# EAGLE design Atmel_ICE3_Adapter_10Pin (EAGLE 6.6.0)
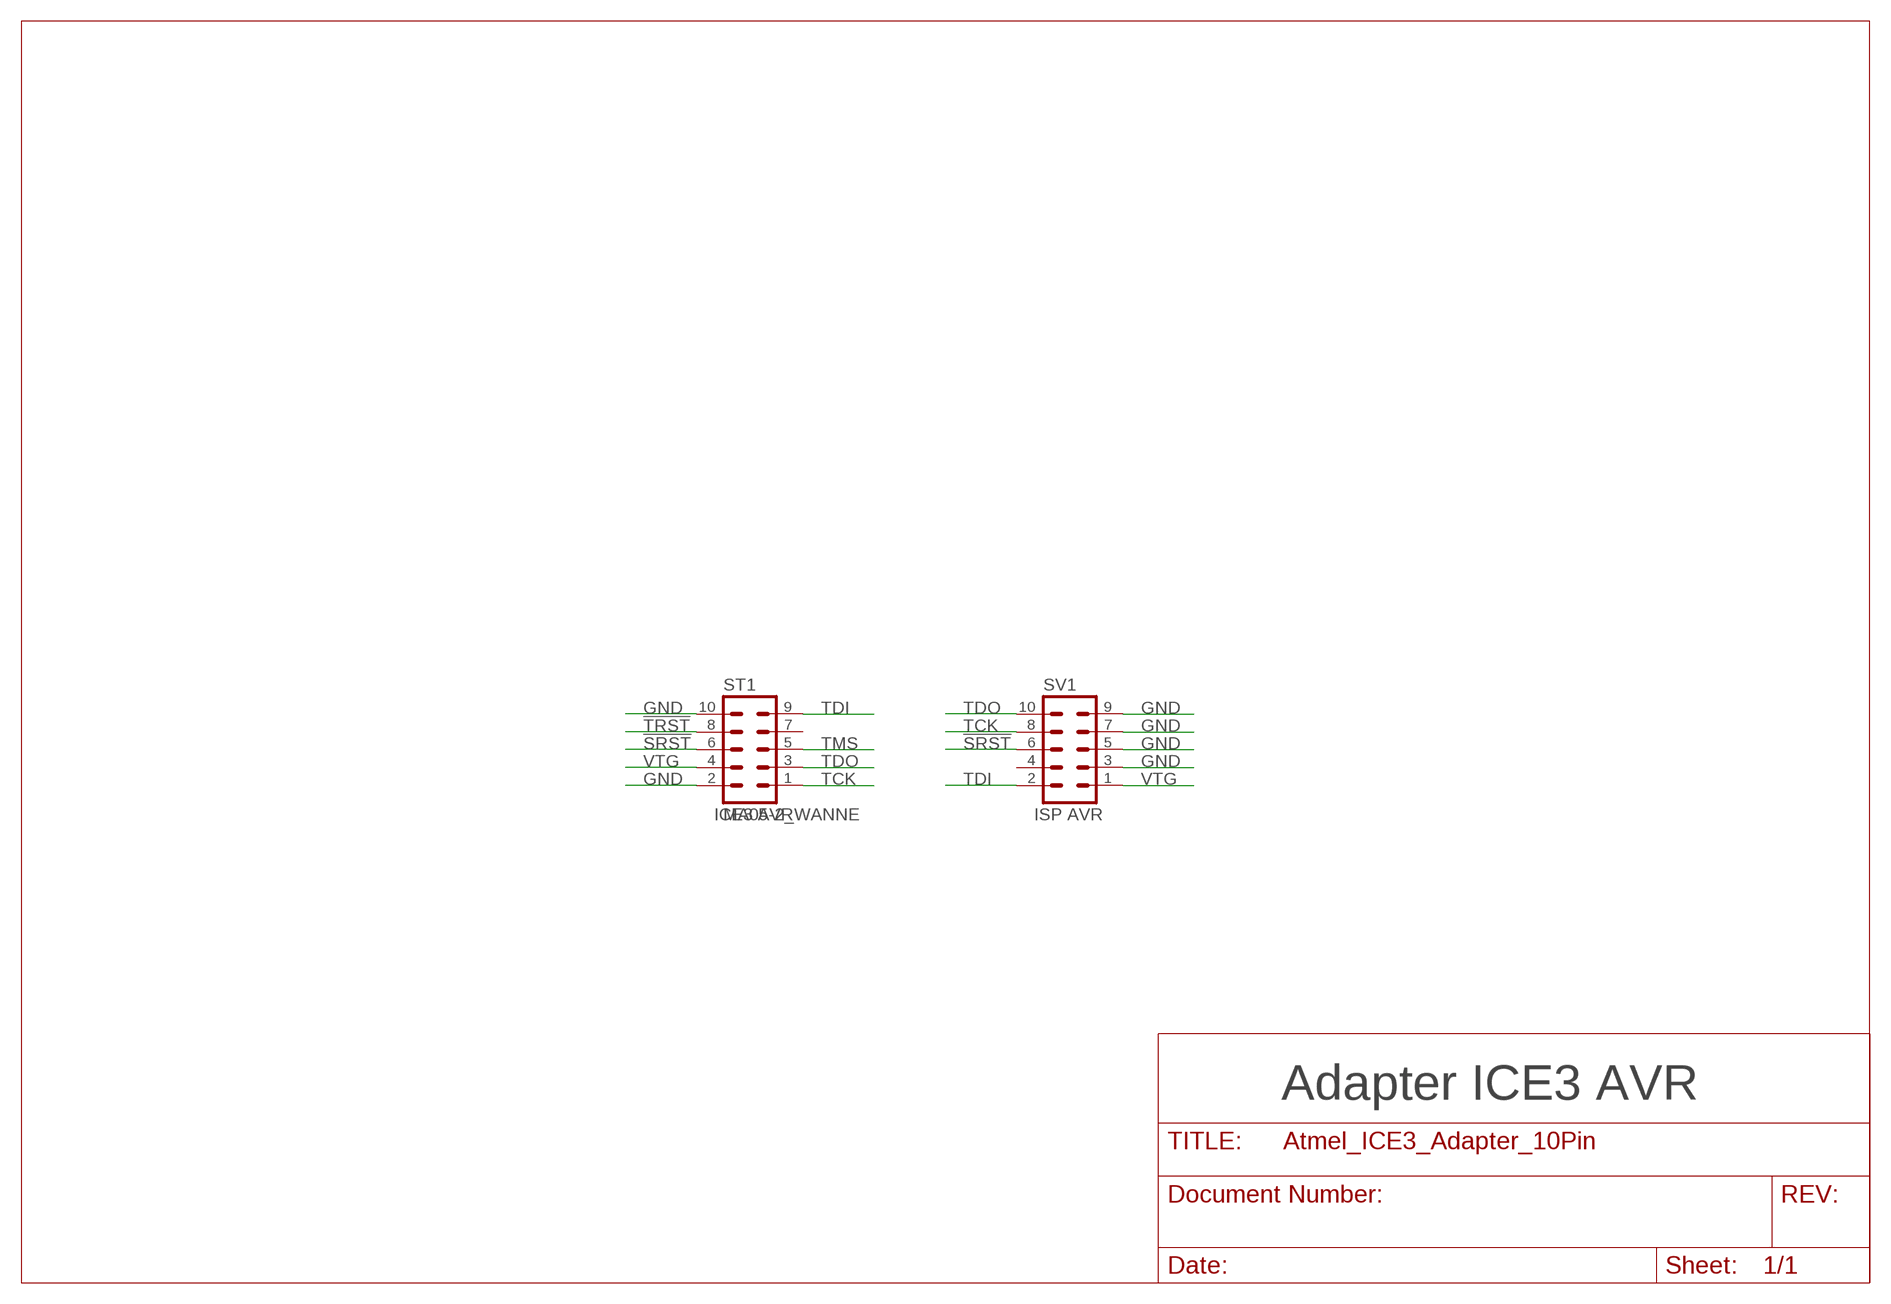
[diagram p0: schematic, sheet 1]

## Parts
ST1  MA05-2_WANNE  [MA05-2_WANNE]
SV1  MA05-2  [MA05-2]

## Nets
!SRST: ST1.6 SV1.6
!TRST: ST1.8
GND [pwr]: ST1.2 ST1.10 SV1.3 SV1.5 SV1.7 SV1.9
TCK: ST1.1 SV1.8
TDI: ST1.9 SV1.2
TDO: ST1.3 SV1.10
TMS: ST1.5
VTG [pwr]: ST1.4 SV1.1
Unconnected: ST1.7 SV1.4

## Notes on the sheet
- ICE3 AVR | ISP AVR
- Adapter ICE3 AVR

## Library data of the parts
ST1 = pin-header-1.27:MA05-2_WANNE
SV1 = con-lstb:MA05-2: PIN HEADER; OC_FARNELL: unknown; OC_NEWARK: unknown

## Board
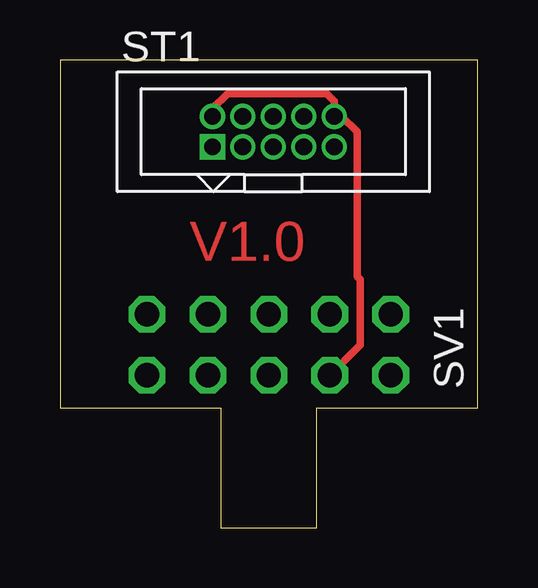
[diagram p1: board, top side]
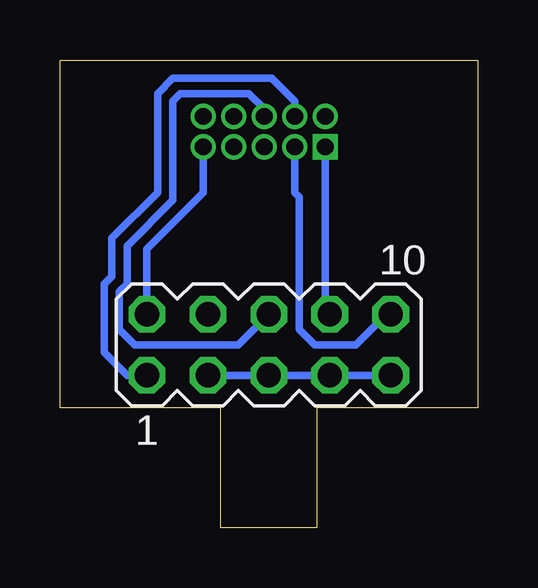
[diagram p2: board, bottom side, seen from below]

Size 17.4 x 19.5 mm. Coordinates in mm from the lower left corner, seen from the top.
Outline: 0,5 6.7,5 6.7,0 10.7,0 10.7,5 17.4,5 17.4,19.5 0,19.5 0,5
Copper layers (1*16): Top 0.035mm / dielectric 1.6mm / Bottom 0.035mm
Design rules "Elecrow_2-layer_PCB_eagle_rule": minimum track width 6mil, minimum drill 12mil, track to track 6mil, track to pad 6mil, pad to pad 6mil, via to via 8mil, smd to smd 0mil, copper to edge 20mil, drill to drill 10mil, minimum pad ring 6mil, minimum via ring 6mil, stop-mask expansion 0mil, vias tented up to drill 100mil, thermal gap 10mil
vRestrict: area 8.9,43.2 to 20.3,44.5; area 1.3,38.1 to 11.4,39.4; area 1.3,25.4 to 11.4,26.7; area 1.3,15.2 to 12.7,16.5; area 31.8,27.9 to 41.9,29.2; area 26.7,40.6 to 38.1,41.9; area 26.7,43.2 to 27.9,44.5; area 36.8,43.2 to 44.5,44.5; area 1.9,41.3 to 2.5,42.5; area 1.3,31.8 to 2.5,33; area 1.3,19.1 to 2.5,20.3; area 1.3,3.8 to 2.5,5.1; 2 more areas

### Footprints (pad centres in the part's own frame; a part is rotated, then mirrored left to right if it is on the bottom)
MA05-2_WANNE = drill 0.7 pad 1.016 square: 1 -2.54,-0.635 | drill 0.7 pad 1.016: 2 -2.54,0.635; 3 -1.27,-0.635; 4 -1.27,0.635; 5 0,-0.635; 6 0,0.635; 7 1.27,-0.635; 8 1.27,0.635; 9 2.54,-0.635; 10 2.54,0.635
MA05-2 = drill 1.016 octagon: 1 -5.08,-1.27; 2 -5.08,1.27; 3 -2.54,-1.27; 4 -2.54,1.27; 5 0,-1.27; 6 0,1.27; 7 2.54,-1.27; 8 2.54,1.27; 9 5.08,-1.27; 10 5.08,1.27

### Placement (x,y rotation side)
ST1  8.89,16.51 0 top
SV1  8.7,7.62 0 bottom

### Tracks (layer width: path | path; a pad name or v marks a point on that pad's centre or on a via)
!SRST
  Bottom 0.305: ST1.6 8.89,17.46 9.53,18.1 12.38,18.1 12.7,17.78 12.7,13.65 14.61,11.75 14.61,10.16 14.92,9.84 14.92,8.26 14.29,7.62 9.97,7.62 SV1.6
GND
  Top 0.305: ST1.2 6.35,17.46 6.99,18.1 11.11,18.1 11.43,17.78 ST1.10 11.75,17.14 12.38,16.51 12.38,10.48 12.51,10.35 12.51,7.62 SV1.3
  Bottom 0.305: SV1.9 SV1.7 SV1.5 SV1.3
TCK
  Bottom 0.305: SV1.8 6.35,8.89 ST1.1
TDI
  Bottom 0.305: SV1.2 13.78,11.62 11.43,13.97 ST1.9
TDO
  Bottom 0.305: SV1.10 3.81,8.89 5.08,7.62 6.79,7.62 7.43,8.26 7.43,13.78 7.62,13.97 ST1.3
VTG
  Bottom 0.305: SV1.1 14.61,6.35 15.56,7.3 15.56,10.16 15.24,10.48 15.24,12.06 13.34,13.97 13.34,18.1 12.7,18.73 8.57,18.73 7.62,17.78 ST1.4

### Text on the board
Top: V1.0